# Altium schematic sheet ПЭ3_2_1.SchDoc: Наименование
size 209 x 297 mm; ApprovedBy: Утвердил; CheckedBy: Проверил; Author: Разработал; CompanyName: ВлГУ; DrawnBy: Н.Контр; Engineer: Т.Контр; SheetNumber: 1; SheetTotal: 1; PageSetup: Record=PageOptions|CenterHorizontal=True|CenterVertical=True|PrintScale=0.94|XCorrection=1.00|YCorrection=1.00|PrintKind=1|BorderSize=5000000|LeftOffset=0|BottomOffset=0|Orientation=1|PaperLength=1000|PaperWidth=1000|Scale=100|PaperSource=7|PrintQuality=-4|MediaType=1|DitherType=10|PaperKind=A4|PrintScaleMode=1; DecimalNumber: Децимальный номер; HeadOfSector: Нач. сектора; MainDevice: Перв.примен.; Name: Наименование; DocumentName: Sheet1.SCHDOC
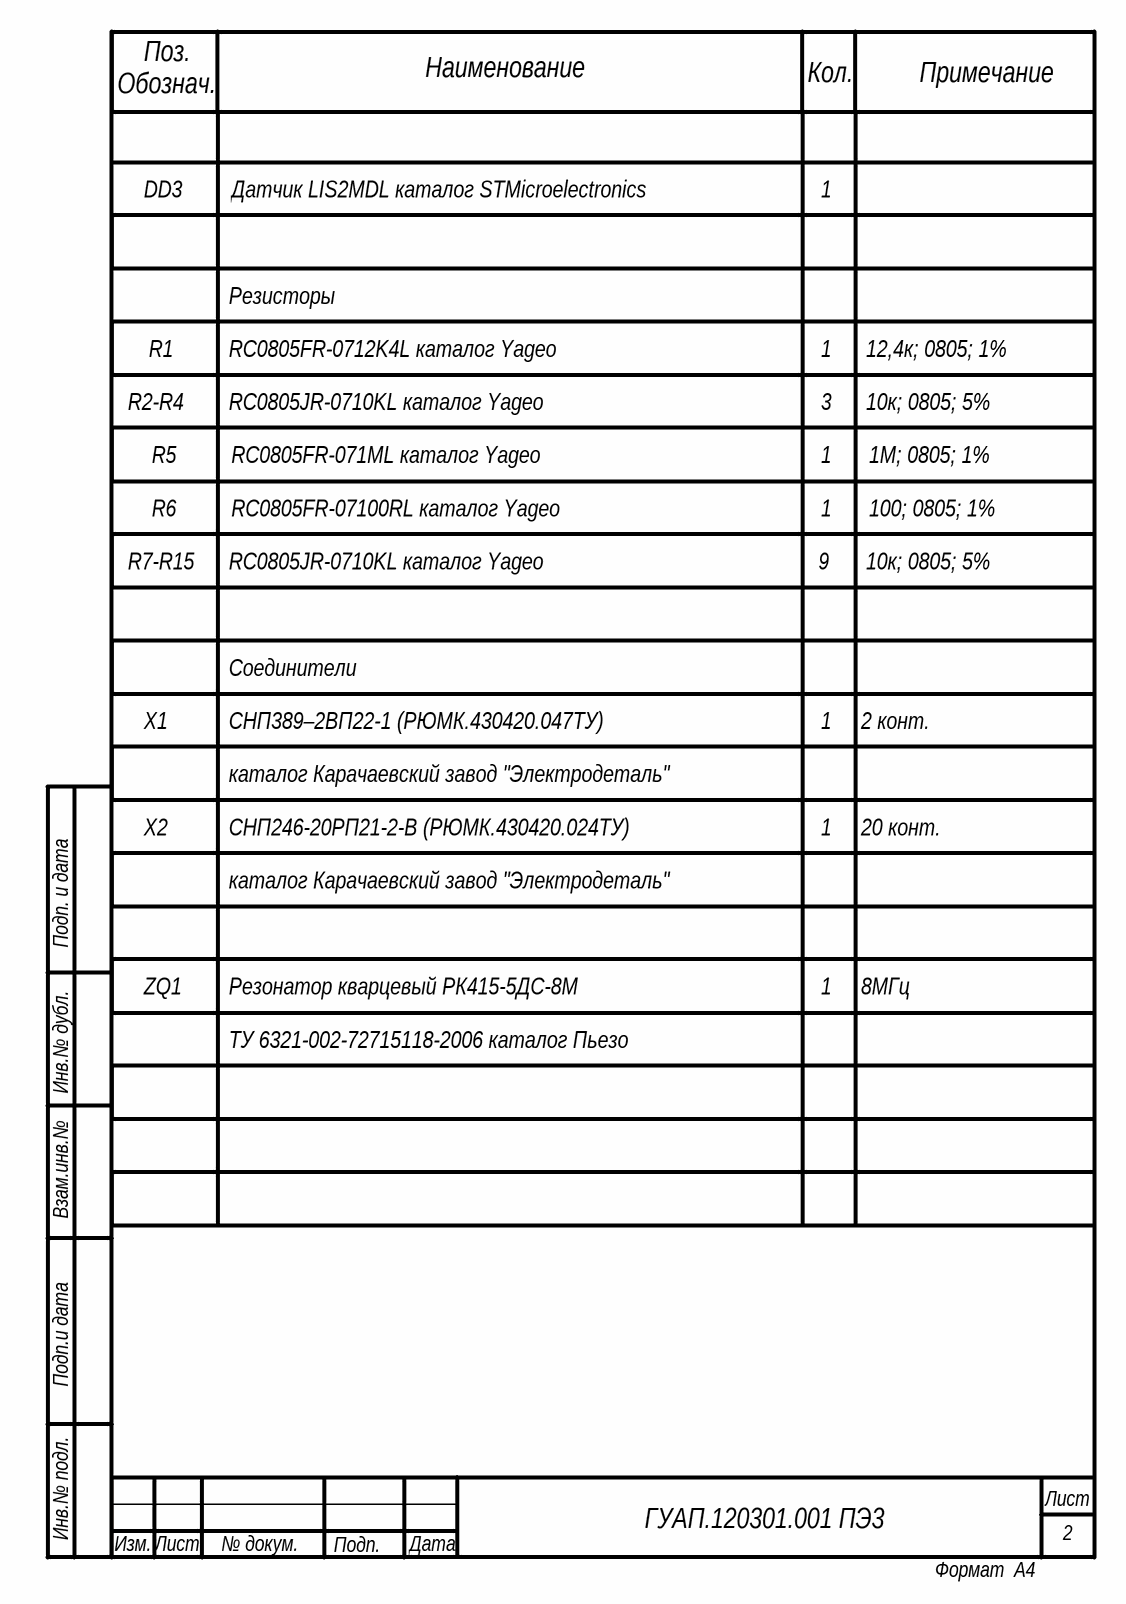
[diagram p0: ПЭ3_2_1.SchDoc]

## Notes on the sheet
- Обознач.
- Поз.
- Наименование
- Кол.
- Примечание
- DD3
- Датчик LIS2MDL каталог STMicroelectronics
- 1
- Резисторы
- R1
- RC0805FR-0712K4L каталог Yageo
- 12,4к; 0805; 1%
- R2-R4
- RC0805JR-0710KL каталог Yageo
- 3
- 10к; 0805; 5%
- R5
- R6
- RC0805FR-071ML каталог Yageo
- RC0805FR-07100RL каталог Yageo
- 1М; 0805; 1%
- 100; 0805; 1%
- R7-R15
- 9
- X1
- Cоединители
- СНП389–2ВП22-1 (РЮМК.430420.047ТУ)
- 2 конт.
- каталог Карачаевский завод "Электродеталь"
- X2
- СНП246-20РП21-2-В (РЮМК.430420.024ТУ)
- 20 конт.
- Подп. и дата
- ZQ1
- Резонатор кварцевый РК415-5ДС-8М
- 8МГц
- Инв.№ дубл.
- ТУ 6321-002-72715118-2006 каталог Пьезо
- Взам.инв.№
- Подп.и дата
- Инв.№ подл.
- Изм.
- Лист
- № докум.
- Подп.
- Дата
- ГУАП.120301.001 ПЭ3
- 2
- Формат  A4